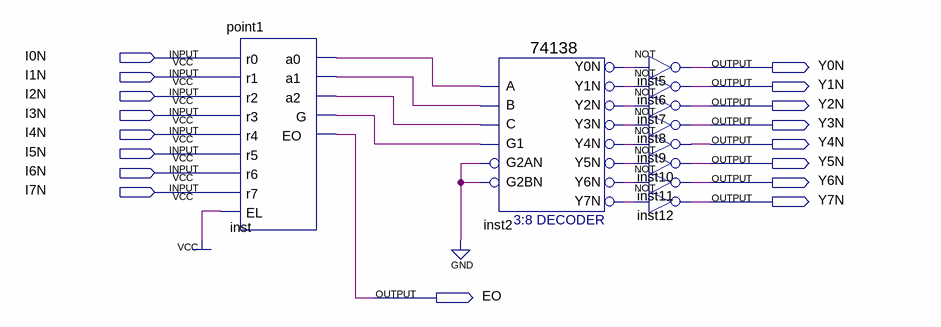
[diagram p0: schematic sheet]
// Quartus schematic point5.bdf as structural Verilog: 10 symbols, 17 pins
module point5 (
  input  I0N,
  input  I1N,
  input  I2N,
  input  I3N,
  input  I4N,
  input  I5N,
  input  I6N,
  input  I7N,
  output Y0N,
  output Y1N,
  output Y2N,
  output Y3N,
  output Y4N,
  output Y5N,
  output Y6N,
  output Y7N,
  output EO
);

  wire inst2_y0n, inst2_y1n, inst2_y2n, inst2_y3n, inst2_y4n, inst2_y5n, inst2_y6n, inst2_y7n, inst_a0,
       inst_a1, inst_a2, inst_g;

  point1 inst (
    .r0(I0N), .r1(I1N), .r2(I2N), .r3(I3N), .r4(I4N), .r5(I5N), .r6(I6N), .r7(I7N), .EL(1'b1), .a0(inst_a0),
    .a1(inst_a1), .a2(inst_a2), .G(inst_g), .EO(EO));
  \74138  inst2 (
    .A(inst_a0), .B(inst_a1), .G1(inst_g), .C(inst_a2), .G2AN(1'b0), .G2BN(1'b0), .Y0N(inst2_y0n),
    .Y1N(inst2_y1n), .Y2N(inst2_y2n), .Y3N(inst2_y3n), .Y4N(inst2_y4n), .Y5N(inst2_y5n), .Y6N(inst2_y6n),
    .Y7N(inst2_y7n));
  not inst5 (Y0N, inst2_y0n);
  not inst6 (Y1N, inst2_y1n);
  not inst7 (Y2N, inst2_y2n);
  not inst8 (Y3N, inst2_y3n);
  not inst9 (Y4N, inst2_y4n);
  not inst10 (Y5N, inst2_y5n);
  not inst11 (Y6N, inst2_y6n);
  not inst12 (Y7N, inst2_y7n);
endmodule
